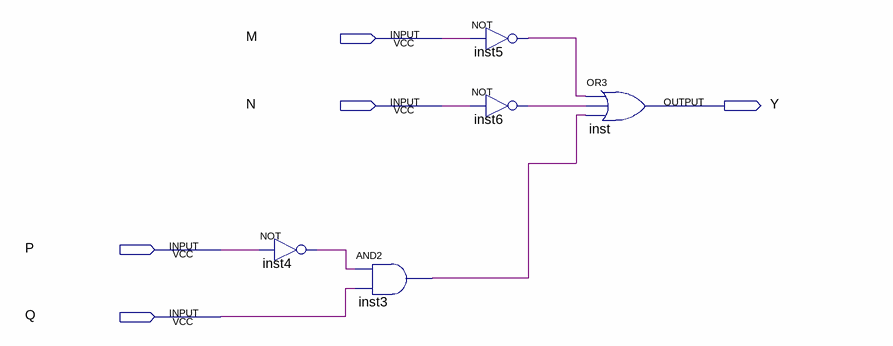
[diagram p0: schematic sheet]
// Quartus schematic LetraC.bdf as structural Verilog: 5 symbols, 5 pins
module LetraC (
  input  M,
  input  N,
  input  P,
  input  Q,
  output Y
);

  wire inst3_out, inst4_out, inst5_out, inst6_out;

  not inst4 (inst4_out, P);
  and inst3 (inst3_out, inst4_out, Q);
  not inst5 (inst5_out, M);
  not inst6 (inst6_out, N);
  or inst (Y, inst5_out, inst6_out, inst3_out);
endmodule
